# Altium schematic sheet Input Conditioning.SchDoc
size A4
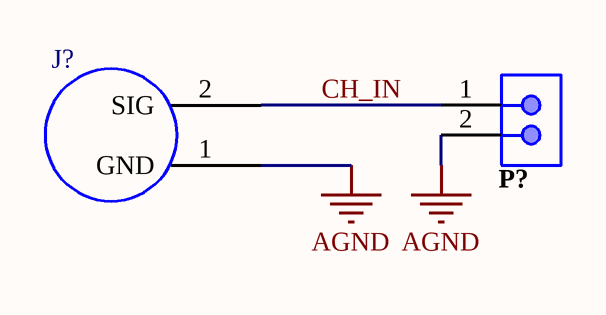
[diagram p0: Input Conditioning.SchDoc]

## Parts
J?  SMA CONNECTOR  [SMA CONNECTOR-Footprint-1]  (value not drawn)
P?  GENERIC 2PIN HEADER MALE  [GENERIC 2PIN HEADER 0]  (value not drawn)

## Nets
AGND: J?.1(GND) P?.2
CH_IN: J?.2(SIG) P?.1

## Library data of the parts
J? = CMP-002-00001-1: Manufacturer: LPRS; Connector Type: SMA,Coaxial; Max Frequency: 6GHz; Impedance: 50R; Supplier No: 471-SMACONNECTOR; Contact Material: Gold; Supplier: Mouser; REACH SVHC: No SVHC; Case/Package: SMA; Contact Plating: Gold
P? = GENERIC 2PIN HEADER MALE-2: CONN MAL TH 2 0Deg HEADER; Bin: B3-J5; Manufacturer: Generic; Design Item ID: GENERIC 2PIN HEADER MALE; Type: TH; Status: Active; Source: Connector Library.SchLib; Case/Package: n/a PIN